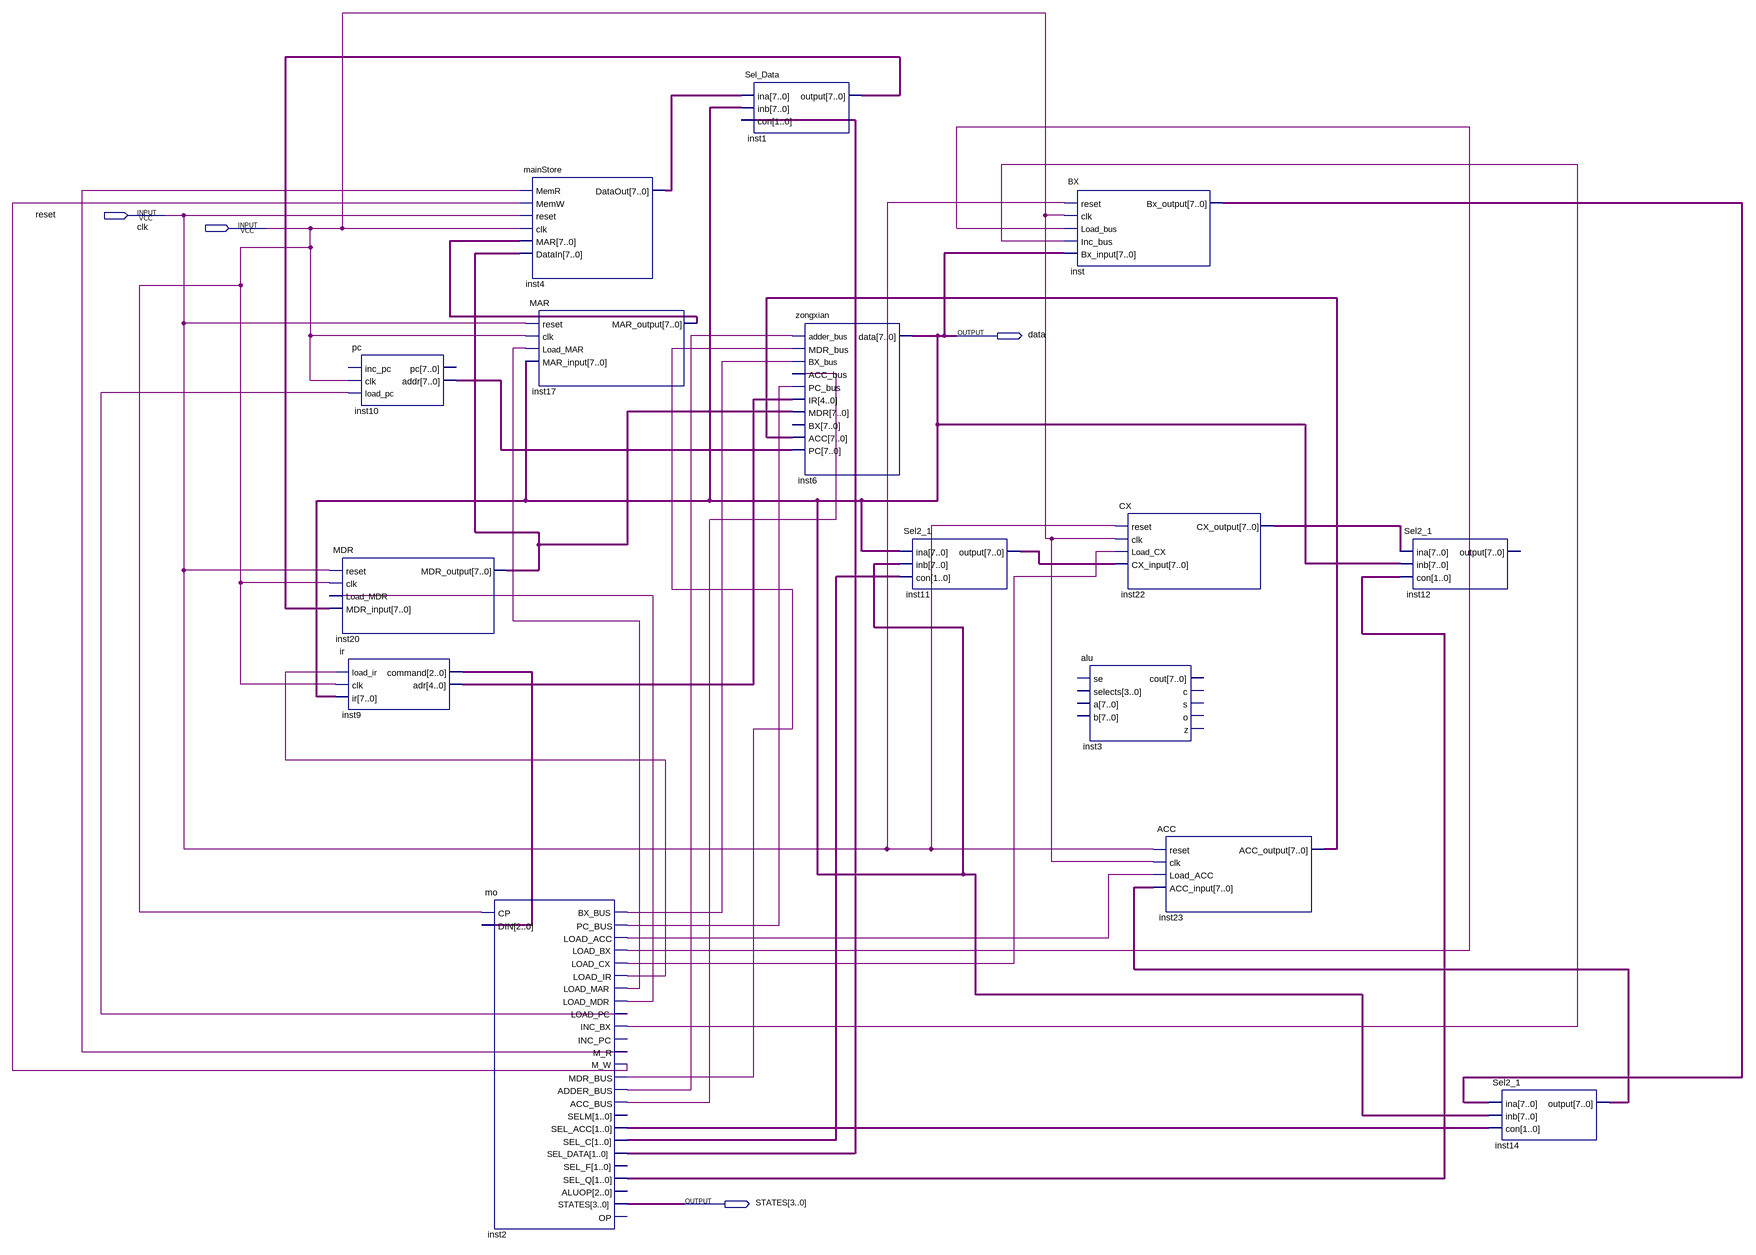
[diagram p0: schematic sheet]
// Quartus schematic Block1.bdf as structural Verilog: 15 symbols, 4 pins
module Block1 (
  input  reset,
  input  clk,
  output data,
  output [3:0] STATES
);

  wire inst2_acc_bus, inst2_adder_bus, inst2_bx_bus, inst2_inc_bx, inst2_load_acc, inst2_load_bx,
       inst2_load_cx, inst2_load_ir, inst2_load_mar, inst2_load_mdr, inst2_load_pc, inst2_m_r, inst2_m_w,
       inst2_mdr_bus, inst2_pc_bus;
  wire [1:0] inst2_sel_acc, inst2_sel_c, inst2_sel_data, inst2_sel_q;
  wire [2:0] inst9_command;
  wire [4:0] inst9_adr;
  wire [7:0] inst1_output, inst4_dataout, inst6_data, inst10_addr, inst11_output, inst14_output,
       inst17_mar_output, inst20_mdr_output, inst22_cx_output, inst23_acc_output, inst_bx_output;

  pc inst10 (.clk(clk), .load_pc(inst2_load_pc), .addr(inst10_addr));  // open: inc_pc, pc
  MDR inst20 (
    .reset(reset), .clk(clk), .Load_MDR(inst2_load_mdr), .MDR_input(inst1_output),
    .MDR_output(inst20_mdr_output));
  ir inst9 (.load_ir(inst2_load_ir), .clk(clk), .ir(inst6_data), .command(inst9_command), .adr(inst9_adr));
  mo inst2 (
    .CP(clk), .DIN(inst9_command), .BX_BUS(inst2_bx_bus), .PC_BUS(inst2_pc_bus), .LOAD_ACC(inst2_load_acc),
    .LOAD_BX(inst2_load_bx), .LOAD_CX(inst2_load_cx), .LOAD_IR(inst2_load_ir), .LOAD_MAR(inst2_load_mar),
    .LOAD_MDR(inst2_load_mdr), .LOAD_PC(inst2_load_pc), .INC_BX(inst2_inc_bx), .M_R(inst2_m_r),
    .M_W(inst2_m_w), .MDR_BUS(inst2_mdr_bus), .ADDER_BUS(inst2_adder_bus), .ACC_BUS(inst2_acc_bus),
    .SEL_ACC(inst2_sel_acc), .SEL_C(inst2_sel_c), .SEL_DATA(inst2_sel_data), .SEL_Q(inst2_sel_q),
    .STATES(STATES));  // open: INC_PC, SELM, SEL_F, ALUOP, OP
  mainStore inst4 (
    .MemR(inst2_m_r), .MemW(inst2_m_w), .reset(reset), .clk(clk), .MAR(inst17_mar_output),
    .DataIn(inst20_mdr_output), .DataOut(inst4_dataout));
  MAR inst17 (
    .reset(reset), .clk(clk), .Load_MAR(inst2_load_mar), .MAR_input(inst6_data),
    .MAR_output(inst17_mar_output));
  Sel_Data inst1 (.ina(inst4_dataout), .inb(inst6_data), .con(inst2_sel_data), .\output (inst1_output));
  zongxian inst6 (
    .adder_bus(inst2_adder_bus), .MDR_bus(inst2_mdr_bus), .BX_bus(inst2_bx_bus), .ACC_bus(inst2_acc_bus),
    .PC_bus(inst2_pc_bus), .IR(inst9_adr), .MDR(inst20_mdr_output), .ACC(inst23_acc_output),
    .PC(inst10_addr), .data(inst6_data));  // open: BX
  Sel2_1 inst11 (.ina(inst6_data), .inb(inst6_data), .con(inst2_sel_c), .\output (inst11_output));
  BX inst (
    .reset(reset), .clk(clk), .Load_bus(inst2_load_bx), .Inc_bus(inst2_inc_bx), .Bx_input(inst6_data),
    .Bx_output(inst_bx_output));
  CX inst22 (.reset(reset), .clk(clk), .Load_CX(inst2_load_cx), .CX_input(inst11_output), .CX_output(inst22_cx_output));
  alu inst3 ();  // open: se, selects, a, b, cout, c, s, o, z
  ACC inst23 (
    .reset(reset), .clk(clk), .Load_ACC(inst2_load_acc), .ACC_input(inst14_output),
    .ACC_output(inst23_acc_output));
  Sel2_1 inst12 (.ina(inst22_cx_output), .inb(inst6_data), .con(inst2_sel_q));  // open: output
  Sel2_1 inst14 (.ina(inst_bx_output), .inb(inst6_data), .con(inst2_sel_acc), .\output (inst14_output));
endmodule
